# EAGLE board SteppyMk2 (EAGLE 9.2.2), part 1 of 2
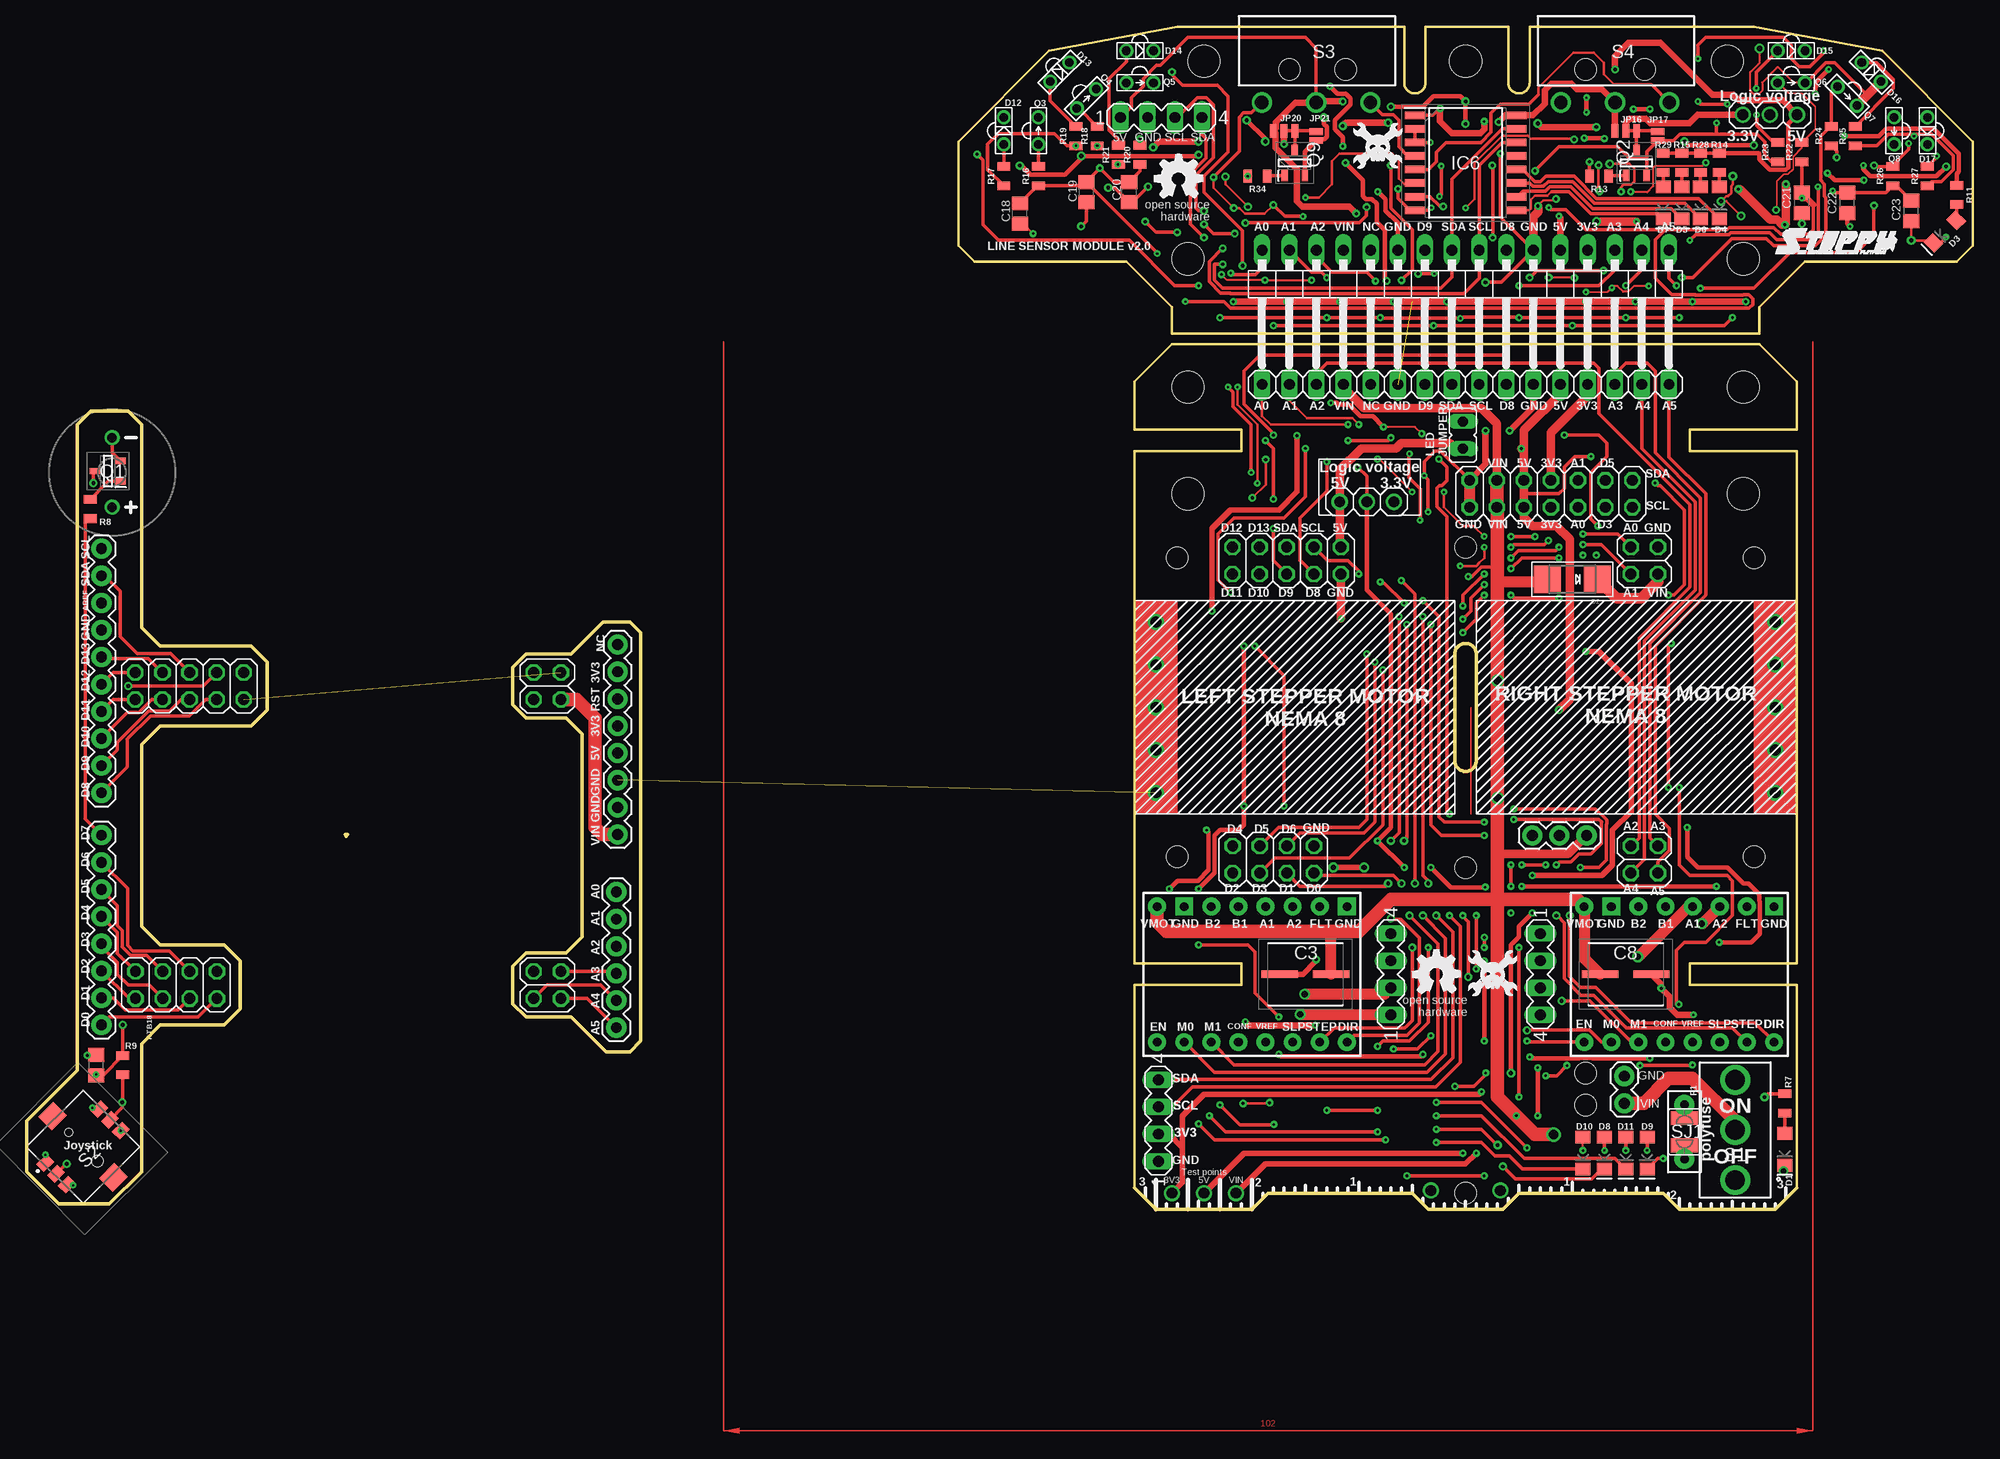
[diagram p3: board, top side]
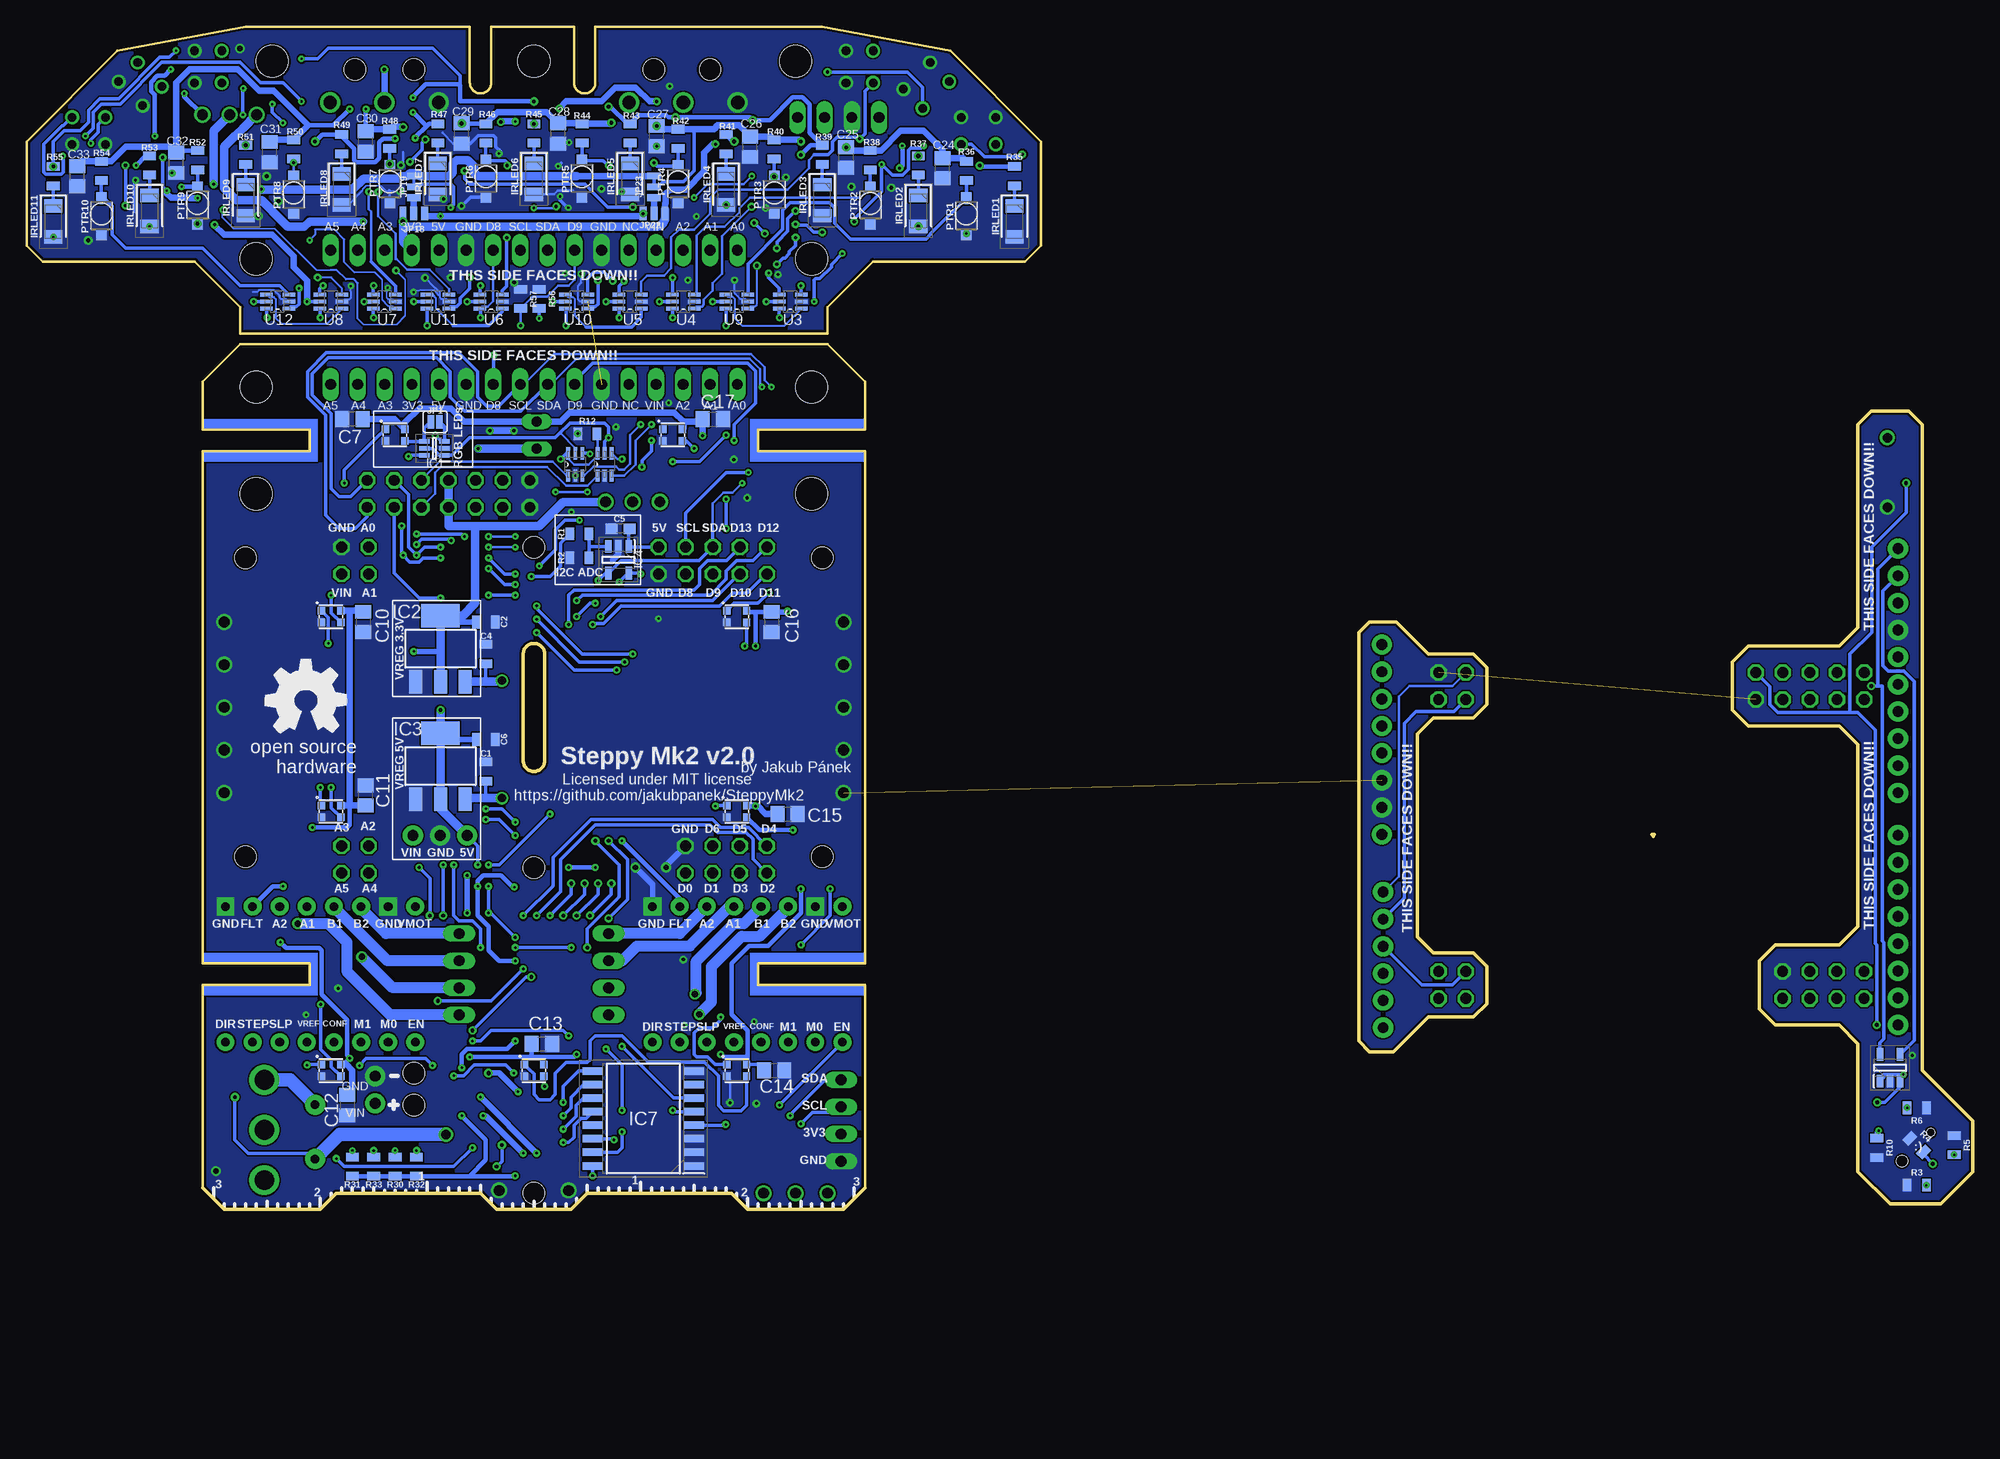
[diagram p4: board, bottom side, seen from below]

Size 182.25 x 110.75 mm. Coordinates in mm from the lower left corner, seen from the top.
Outline: 29.83,35.11 30.06,35.11
Outline: 29.93,35.09 29.93,34.91
Outline: 107.25,82 162.25,82 162.25,84.5 166.5,88.75 180.75,88.75 182.25,90.25 182.25,100 173.75,108.5 161.75,110.75 140.75,110.75 140.75,105.5 arc-90 139.75,104.5 arc-90 138.75,105.5 138.75,110.75 131,110.75 131,105.5 arc-90 130,104.5 arc-90 129,105.5 129,110.75 107.75,110.75 95.75,108.5 87.25,100 87.25,90.25 88.75,88.75 103,88.75 107.25,84.5 107.25,82
Outline: 7.75,0.5 3,0.5 0,3.5 0,8.25 4.75,13 4.75,73.5 6,74.75 9.5,74.75 10.75,73.5 10.75,54.5 12.5,52.75 21,52.75 22.5,51.25 22.5,46.75 21,45.25 12.5,45.25 10.75,43.5 10.75,26.5 12.5,24.75 18.5,24.75 20,23.25 20,18.75 18.5,17.25 12.5,17.25 10.75,15.5 10.75,3.5 7.75,0.5
Outline: 54.25,14.75 56.5,14.75 57.5,15.75 57.5,54 56.5,55 54,55 51,52 46.75,52 45.5,50.75 45.5,47.25 46.75,46 50.5,46 52,44.5 52,25.5 50.5,24 46.75,24 45.5,22.75 45.5,19.25 46.75,18 51,18 54.25,14.75
Outline: 105.75,0 114.75,0 116.25,1.5 129.75,1.5 131.25,0 138.25,0 139.75,1.5 153.25,1.5 154.75,0 163.75,0 165.75,2 165.75,21 155.75,21 155.75,23 165.75,23 165.75,71 155.75,71 155.75,73 165.75,73 165.75,77.5 162.25,81 107.25,81 103.75,77.5 103.75,73 113.75,73 113.75,71 103.75,71 103.75,23 113.75,23 113.75,21 103.75,21 103.75,2 105.75,0
Outline: 133.75,42 133.75,52 arc-90 134.75,53 arc-90 135.75,52 135.75,42 arc-90 134.75,41 arc-90 133.75,42
Copper layers (1*16): Top 0.035mm / dielectric 1.5mm / Bottom 0.035mm
Design rules "default *": minimum track width 6mil, minimum drill 0.2mm, track to track 6mil, track to pad 6mil, pad to pad 6mil, via to via 6mil, smd to smd 6mil, copper to edge 0.2mm, drill to drill 6mil, minimum pad ring 10mil, minimum via ring 8mil, stop-mask expansion 4mil, vias tented up to drill 0mil, thermal gap 10mil
Holes 2 mm at 134.75,32 134.75,62 146,106.75 151.5,106.75 118.25,106.75 123.5,106.75 134.75,1.5 146,12.75 146,9.75 107.75,33 107.75,61 161.75,33 161.75,61
Holes 3 mm at 160.75,77 108.75,77 108.75,89 160.75,89 110.25,107.5 159.25,107.5 108.75,67 160.75,67 134.75,107.5

## Footprints (pad centres in the part's own frame; a part is rotated, then mirrored left to right if it is on the bottom)
0805 = smd 0.8 x 1.2: 1 -0.9,0; 2 0.9,0
CAPM7058X610N = smd 3.4 x 0.7: 1 -2.4,0; 2 2.4,0
0603 = smd 1.1 x 1: 1 -0.85,0; 2 0.85,0
C0805 = smd 1.3 x 1.5: 1 -0.95,0; 2 0.95,0
LED-1206 = smd 1.2 x 1.4: A -1.5,0; C 1.5,0
SMADIODE = smd 2.54 x 2.54: A 2.349,0; C -2.349,0
LTE-302 = drill 0.8: A 1.27,0; C -1.27,0
POLOLU-DRV8825 = drill 0.8 pad 1.676: A1 6.35,-1.27; A2 6.35,-3.81; B1 6.35,1.27; B2 6.35,3.81; CONFIG -6.35,1.27; DIR -6.35,-8.89; EN -6.35,8.89; FLT 6.35,-6.35; M0 -6.35,6.35; M1 -6.35,3.81; SLP -6.35,-3.81; STEP -6.35,-6.35; VMOT 6.35,8.89; VREF -6.35,-1.27 | drill 0.8 pad 1.676 square: GND0 6.35,6.35; GND1 6.35,-8.89
PTH = drill 0.8 pad 1.88: P$1 -2.54,0; P$2 2.54,0
SOT65P210X110-6N = smd 1 x 0.45: 1 -0.95,0.65; 2 -0.95,0; 3 -0.95,-0.65; 4 0.95,-0.65; 5 0.95,0; 6 0.95,0.65
SOT223 = smd 1.219 x 2.235: 1 -2.311,-3.099; 2 0,-3.099; 3 2.311,-3.099 | smd 3.6 x 2.2: TAB 0,3.099
SOT95P280X145-5N = smd 1.2 x 0.6: 1 -1.25,0.95; 2 -1.25,0; 3 -1.25,-0.95; 4 1.25,-0.95; 5 1.25,0.95
SOIC127P1032X265-16N = smd 1.95 x 0.7: 1 -4.725,4.445; 2 -4.725,3.175; 3 -4.725,1.905; 4 -4.725,0.635; 5 -4.725,-0.635; 6 -4.725,-1.905; 7 -4.725,-3.175; 8 -4.725,-4.445; 9 4.725,-4.445; 10 4.725,-3.175; 11 4.725,-1.905; 12 4.725,-0.635; 13 4.725,0.635; 14 4.725,1.905; 15 4.725,3.175; 16 4.725,4.445
LEDC3215X130N = smd 1.25 x 1.7: 1 -1.45,0; 2 1.45,0
1X02 = drill 1.016 pad 1.88: 1 0,0; 2 2.54,0
1X08 = drill 1.016 pad 1.88: 1 0,0; 2 2.54,0; 3 5.08,0; 4 7.62,0; 5 10.16,0; 6 12.7,0; 7 15.24,0; 8 17.78,0
1X06 = drill 1.016 pad 1.88: 1 0,0; 2 2.54,0; 3 5.08,0; 4 7.62,0; 5 10.16,0; 6 12.7,0
1X10 = drill 1.016 pad 1.88: 1 0,0; 2 2.54,0; 3 5.08,0; 4 7.62,0; 5 10.16,0; 6 12.7,0; 7 15.24,0; 8 17.78,0; 9 20.32,0; 10 22.86,0
1X03 = drill 1.016 pad 1.88: 1 0,0; 2 2.54,0; 3 5.08,0
SMT-JUMPER_2_NC_PASTE_SILK = smd 0.635 x 1.27: 1 -0.406,0; 2 0.406,0
JP1 = drill 0.914 long: 1 0,-1.27; 2 0,1.27
2X02 = drill 1.016 octagon: 1 -1.27,-1.27; 2 -1.27,1.27; 3 1.27,-1.27; 4 1.27,1.27
2X07 = drill 1.016 octagon: 1 -7.62,-1.27; 2 -7.62,1.27; 3 -5.08,-1.27; 4 -5.08,1.27; 5 -2.54,-1.27; 6 -2.54,1.27; 7 0,-1.27; 8 0,1.27; 9 2.54,-1.27; 10 2.54,1.27; 11 5.08,-1.27; 12 5.08,1.27; 13 7.62,-1.27; 14 7.62,1.27
2X05 = drill 1.016 octagon: 1 -5.08,-1.27; 2 -5.08,1.27; 3 -2.54,-1.27; 4 -2.54,1.27; 5 0,-1.27; 6 0,1.27; 7 2.54,-1.27; 8 2.54,1.27; 9 5.08,-1.27; 10 5.08,1.27
2X04 = drill 1.016 octagon: 1 -3.81,-1.27; 2 -3.81,1.27; 3 -1.27,-1.27; 4 -1.27,1.27; 5 1.27,-1.27; 6 1.27,1.27; 7 3.81,-1.27; 8 3.81,1.27
1X16/90 = drill 1.016 long: 1 -19.05,-3.81; 2 -16.51,-3.81; 3 -13.97,-3.81; 4 -11.43,-3.81; 5 -8.89,-3.81; 6 -6.35,-3.81; 7 -3.81,-3.81; 8 -1.27,-3.81; 9 1.27,-3.81; 10 3.81,-3.81; 11 6.35,-3.81; 12 8.89,-3.81; 13 11.43,-3.81; 14 13.97,-3.81; 15 16.51,-3.81; 16 19.05,-3.81
1X16 = drill 1.016 long: 1 -19.05,0; 2 -16.51,0; 3 -13.97,0; 4 -11.43,0; 5 -8.89,0; 6 -6.35,0; 7 -3.81,0; 8 -1.27,0; 9 1.27,0; 10 3.81,0; 11 6.35,0; 12 8.89,0; 13 11.43,0; 14 13.97,0; 15 16.51,0; 16 19.05,0
1X03' = drill 1.016: 1 -2.54,0; 2 0,0; 3 2.54,0
SMT-JUMPER_3_1-NC_TRACE_NO-SILK = smd 0.635 x 1.27: 1 -1.016,0; 2 0,0; 3 1.016,0
SMT-JUMPER_2_NO_NO-SILK = smd 0.635 x 1.27: 1 -0.406,0; 2 0.406,0
SMT-JUMPER_3_0-NO_TRACE_NO-SILK = smd 0.635 x 1.27: 1 -1.016,0; 2 0,0; 3 1.016,0
BUZZER-12MM-NS = drill 0.9: + 3.25,0; - -3.25,0
WS2812-2020 = smd 0.7 x 0.7: 1 0.915,-0.55; 2 0.915,0.55; 3 -0.915,0.55; 4 -0.915,-0.55
TEMT1020 = smd 1.1 x 1: 1 -1.7,0; 2 1.7,0
SOT96P237X111-3N = smd 1 x 0.6: 1 -1.2,0.955; 2 -1.2,-0.955; 3 1.2,0
LTR-301 = drill 0.8: C 1.27,0; E -1.27,0
5MS1S102AM2QES = drill 1.85 pad 2.8: 1 0,-4.7; 2 0,0; 3 0,4.7
SKRHABE010 = smd 1.35 x 1: 1 -3.575,1.425; 2 -3.575,0; 3 -3.575,-1.425; 4 3.575,1.425; 5 3.575,0; 6 3.575,-1.425 | smd 2 x 1.8: 7 0,4.05; 8 0,-4.05 | hole 0.75: 0,1.9 | hole 1.05: 0,-1.9
AH186061A = drill 1.25 pad 1.9: 1 -5.08,1.6; 2 0,1.6; 3 5.08,1.6
SJW = smd 1.27 x 2.54: 1 -1.27,0; 2 1.27,0
MA04-1 = drill 1.016 long: 1 -3.81,0; 2 -1.27,0; 3 1.27,0; 4 3.81,0
SOT65P210X110-6N' = smd 1.168 x 0.356: 1 -1.041,0.66; 2 -1.041,0; 3 -1.041,-0.66; 4 1.041,-0.66; 5 1.041,0; 6 1.041,0.66

## Placement (x,y rotation side)
C1  10uF  [0805]  139.25,41 90 bottom
C2  10uF  [0805]  139.25,55 0 bottom
C3  100UF  [CAPM7058X610N]  119.75,22 0 top
C4  10uF  [0805]  139.25,52 90 bottom
C5  0.1uF  [0603]  126.63,63.73 180 bottom
C6  10uF  [0805]  139.25,44 0 bottom
C7  0.1uF  [C0805]  151.75,74 180 bottom
C8  100UF  [CAPM7058X610N]  149.75,22 180 top
C9  0.1uF  [C0805]  6.5,13.5 90 top
C10  0.1uF  [C0805]  150.75,55 270 bottom
C11  0.1uF  [C0805]  150.5,38.75 90 bottom
C12  0.1uF  [C0805]  152.25,9.75 270 bottom
C13  0.1uF  [C0805]  134,15.5 0 bottom
C14  0.1uF  [C0805]  112.25,13 0 bottom
C15  0.1uF  [C0805]  111,37 0 bottom
C16  0.1uF  [C0805]  112.5,55 270 bottom
C17  0.1uF  [C0805]  118,74 0 bottom
C18  [C0805]  93,93.25 90 top
C19  [C0805]  99.25,95.25 90 top
C20  [C0805]  103.25,95.25 90 top
C21  [C0805]  166.25,94.25 90 top
C22  [C0805]  170.5,94.25 90 top
C23  [C0805]  176.5,93.5 90 top
C24  [C0805]  96.5,97.5 90 bottom
C25  [C0805]  105.5,98.5 90 bottom
C26  [C0805]  114.5,99.5 90 bottom
C27  [C0805]  123.25,100.5 90 bottom
C28  [C0805]  132.5,100.75 90 bottom
C29  [C0805]  141.5,100.75 90 bottom
C30  [C0805]  150.5,100 90 bottom
C31  [C0805]  159.5,99 90 bottom
C32  [C0805]  168.25,98 90 bottom
C33  [C0805]  177.5,96.75 90 bottom
D1  GREEN  [LED-1206]  164.65,5.6 270 top
D2  [SMADIODE]  144.75,59 180 top
D3  GREEN  [LED-1206]  179.64,91.55 225 top
D4  GREEN  [LED-1206]  158.5,94.25 270 top
D5  GREEN  [LED-1206]  155,94.25 270 top
D6  GREEN  [LED-1206]  156.75,94.25 270 top
D7  GREEN  [LED-1206]  153.25,94.25 270 top
D8  GREEN  [LED-1206]  147.75,5.25 270 top
D9  GREEN  [LED-1206]  151.75,5.25 270 top
D10  GREEN  [LED-1206]  145.75,5.25 270 top
D11  GREEN  [LED-1206]  149.75,5.25 270 top
D12  [LTE-302]  91.5,101 270 top
D13  [LTE-302]  96.75,106.5 225 top
D14  [LTE-302]  104.25,108.5 180 top
D15  [LTE-302]  165.25,108.5 180 top
D16  [LTE-302]  172.75,106.5 135 top
D17  [LTE-302]  178,101 90 top
DRV1  POLOLU-DRV8825  [POLOLU-DRV8825]  154.75,22 90 top
DRV2  POLOLU-DRV8825  [POLOLU-DRV8825]  114.75,22 90 top
F1  [PTH]  155.25,7.25 270 top
GOLD_ORB_SM1  OSHWLOGOLOGO8MM  [OSHW_8MM]  156.12,47.62 0 bottom
GOLD_ORB_SM2  OSHWLOGOLOGO5MM  [OSHW_5MM]  132,22 0 top
GOLD_ORB_SM3  OSHWLOGOLOGO5MM  [OSHW_5MM]  107.88,96.5 0 top
IC1  74LVC1T45GW,125  [SOT65P210X110-6N]  144.07,71.26 180 bottom
IC2  AP1117E33G-13  [SOT223]  143.5,52.5 0 bottom
IC3  TS1117BCW-5.0  [SOT223]  143.5,41.5 0 bottom
IC4  MCP3021A0T-E_OT  [SOT95P280X145-5N]  126.83,60.83 270 bottom
IC5  MCP3021A1T-E_OT  [SOT95P280X145-5N]  7.75,13.25 90 bottom
IC6  PCF8574T_3,518  [SOIC127P1032X265-16N]  134.75,98 0 top
IC7  PCF8574T_3,518  [SOIC127P1032X265-16N]  124.5,8.5 180 bottom
IRLED1  LL-S150IRC-2A  [LEDC3215X130N]  89.75,92.5 270 bottom
IRLED2  LL-S150IRC-2A  [LEDC3215X130N]  98.75,93.5 270 bottom
IRLED3  LL-S150IRC-2A  [LEDC3215X130N]  107.75,94.5 270 bottom
IRLED4  LL-S150IRC-2A  [LEDC3215X130N]  116.75,95.5 270 bottom
IRLED5  LL-S150IRC-2A  [LEDC3215X130N]  125.75,96.5 270 bottom
IRLED6  LL-S150IRC-2A  [LEDC3215X130N]  134.75,96.5 270 bottom
IRLED7  LL-S150IRC-2A  [LEDC3215X130N]  143.75,96.5 270 bottom
IRLED8  LL-S150IRC-2A  [LEDC3215X130N]  152.75,95.5 270 bottom
IRLED9  LL-S150IRC-2A  [LEDC3215X130N]  161.75,94.5 270 bottom
IRLED10  LL-S150IRC-2A  [LEDC3215X130N]  170.75,93.5 270 bottom
IRLED11  LL-S150IRC-2A  [LEDC3215X130N]  179.75,92.5 270 bottom
J1  [1X02]  149.62,12.46 270 top
J2  [1X08]  55.34,52.88 270 top
J3  [1X06]  55.22,29.71 270 top
J4  [1X10]  7,39 90 top
J5  [1X08]  7,17.25 90 top
J6  455-1750-1-ND  [1X03]  141,35 0 top
JP1  JUMPER-SMT_2_NC_PASTE_SILK  [SMT-JUMPER_2_NC_PASTE_SILK]  144,73.75 180 bottom
JP2  [JP1]  134.5,72.5 180 top
JP3  [2X02]  48.75,49 270 top
JP4  [2X02]  48.75,21 270 top
JP5  [2X07]  142.75,67 180 top
JP6  [2X05]  15.25,49 180 top
JP7  [2X04]  14,21 180 top
JP8  [2X02]  151.5,60.75 270 top
JP9  [2X02]  151.5,32.75 270 top
JP10  [2X05]  118,60.75 180 top
JP11  [2X04]  116.75,32.75 180 top
JP12  [1X16/90]  134.75,86 180 top
JP13  [1X16]  134.75,77.25 0 top
JP14  [1X03']  163.25,102.5 0 top
JP15  [1X03']  125.5,66.25 180 top
JP16  JUMPER-SMT_3_1-NC_TRACE_NO-SILK  [SMT-JUMPER_3_1-NC_TRACE_NO-SILK]  149.75,101 0 top
JP17  JUMPER-SMT_2_NO_NO-SILK  [SMT-JUMPER_2_NO_NO-SILK]  152.75,100.5 90 top
JP18  JUMPER-SMT_3_NO_NO_SILK  [SMT-JUMPER_3_0-NO_TRACE_NO-SILK]  146,93.25 180 bottom
JP19  JUMPER-SMT_3_1-NC_TRACE_NO-SILK  [SMT-JUMPER_3_1-NC_TRACE_NO-SILK]  146,95.75 90 bottom
JP20  JUMPER-SMT_3_1-NC_TRACE_NO-SILK  [SMT-JUMPER_3_1-NC_TRACE_NO-SILK]  117.75,101 0 top
JP21  JUMPER-SMT_2_NO_NO-SILK  [SMT-JUMPER_2_NO_NO-SILK]  120.75,100.5 90 top
JP22  JUMPER-SMT_3_NO_NO_SILK  [SMT-JUMPER_3_0-NO_TRACE_NO-SILK]  123.5,93.25 0 bottom
JP23  JUMPER-SMT_3_1-NC_TRACE_NO-SILK  [SMT-JUMPER_3_1-NC_TRACE_NO-SILK]  123.5,95.75 90 bottom
LS1  BUZZER-PTH_NO_SILK  [BUZZER-12MM-NS]  8,69 270 top
PLED1  WS2812-2020  [WS2812-2020]  147.75,72.5 180 bottom
PLED2  WS2812-2020  [WS2812-2020]  153.75,55.5 180 bottom
PLED3  WS2812-2020  [WS2812-2020]  153.75,37.25 180 bottom
PLED4  WS2812-2020  [WS2812-2020]  153.75,13 180 bottom
PLED5  WS2812-2020  [WS2812-2020]  134.75,13 180 bottom
PLED6  WS2812-2020  [WS2812-2020]  115.75,13 180 bottom
PLED7  WS2812-2020  [WS2812-2020]  115.75,37.25 180 bottom
PLED8  WS2812-2020  [WS2812-2020]  115.75,55.5 180 bottom
PLED9  WS2812-2020  [WS2812-2020]  121.75,72.5 180 bottom
PTR1  TEMT1020  [TEMT1020]  94.25,93 270 bottom
PTR2  TEMT1020  [TEMT1020]  103.25,94 270 bottom
PTR3  TEMT1020  [TEMT1020]  112.25,95 270 bottom
PTR4  TEMT1020  [TEMT1020]  121.25,96 270 bottom
PTR5  TEMT1020  [TEMT1020]  130.25,96.5 270 bottom
PTR6  TEMT1020  [TEMT1020]  139.25,96.5 270 bottom
PTR7  TEMT1020  [TEMT1020]  148.25,96 270 bottom
PTR8  TEMT1020  [TEMT1020]  157.25,95 270 bottom
PTR9  TEMT1020  [TEMT1020]  166.25,94 270 bottom
PTR10  TEMT1020  [TEMT1020]  175.25,93 270 bottom
Q1  SBC817-40LT1G  [SOT96P237X111-3N]  7.6,69.13 180 top
Q2  SBC817-40LT1G  [SOT96P237X111-3N]  150.75,98 90 top
Q3  [LTR-301]  94.75,101 270 top
Q4  [LTR-301]  99.25,104 225 top
Q5  [LTR-301]  104.25,105.5 180 top
Q6  [LTR-301]  165.25,105.5 180 top
Q7  [LTR-301]  170.5,104.25 135 top
Q8  [LTR-301]  174.88,101 90 top
Q9  SBC817-40LT1G  [SOT96P237X111-3N]  118.75,98 90 top
R1  10K  [0805]  130.5,63.25 0 bottom
R2  10K  [0805]  130.5,61 180 bottom
R3  8k2  [0805]  5.25,2.25 0 bottom
R4  4k7  [0805]  5.25,6 315 bottom
R5  2k  [0805]  1.75,6 270 bottom
R6  16k  [0805]  5.25,9.5 180 bottom
R7  4K7  [0805]  164.64,9.91 270 top
R8  4.7K  [0805]  5.94,65.58 270 top
R9  1M  [0805]  9,13.5 90 top
R10  33k  [0805]  9,5.75 270 bottom
R11  330  [0805]  180.75,95 270 top
R12  330K  [0805]  129.75,72.62 0 bottom
R13  4.7K  [0805]  147.25,96.75 180 top
R14  4k7  [0805]  158.5,98 270 top
R15  4k7  [0805]  155,98 270 top
R16  10K  [0805]  94.75,96.75 90 top
R17  330  [0805]  91.5,96.75 90 top
R18  10K  [0805]  100.25,100.5 90 top
R19  330  [0805]  98.25,100.5 90 top
R20  10K  [0805]  104.25,98.75 90 top
R21  330  [0805]  102.25,98.75 90 top
R22  10K  [0805]  166.25,99 90 top
R23  330  [0805]  164,99 90 top
R24  10K  [0805]  169,100.5 90 top
R25  330  [0805]  171.25,100.5 90 top
R26  10K  [0805]  174.75,96.75 90 top
R27  330  [0805]  178,96.75 90 top
R28  4k7  [0805]  156.75,98 270 top
R29  4k7  [0805]  153.25,98 270 top
R30  4k7  [0805]  147.75,4 90 bottom
R31  4k7  [0805]  151.75,4 90 bottom
R32  4k7  [0805]  145.75,4 90 bottom
R33  4k7  [0805]  149.75,4 90 bottom
R34  4.7K  [0805]  115.25,96.75 180 top
R35  330  [0805]  89.75,96.75 270 bottom
R36  10K  [0805]  94.25,97.25 270 bottom
R37  330  [0805]  98.75,97.75 270 bottom
R38  10K  [0805]  103.25,98.25 270 bottom
R39  330  [0805]  107.75,98.75 270 bottom
R40  10K  [0805]  112.25,99.25 270 bottom
R41  330  [0805]  116.75,99.75 270 bottom
R42  10K  [0805]  121.25,100.25 270 bottom
R43  330  [0805]  125.75,100.75 270 bottom
R44  10K  [0805]  130.25,100.75 270 bottom
R45  330  [0805]  134.75,100.75 270 bottom
R46  10K  [0805]  139.25,100.75 270 bottom
R47  330  [0805]  143.75,100.75 270 bottom
R48  10K  [0805]  148.25,100.25 270 bottom
R49  330  [0805]  152.75,99.75 270 bottom
R50  10K  [0805]  157.25,99.25 270 bottom
R51  330  [0805]  161.75,98.75 270 bottom
R52  10K  [0805]  166.25,98.25 270 bottom
R53  330  [0805]  170.75,97.75 270 bottom
R54  10K  [0805]  175.25,97.25 270 bottom
R55  330  [0805]  179.75,96.75 270 bottom
R56  330K  [0805]  134.25,85.25 270 bottom
R57  330K  [0805]  136,85.25 270 bottom
S1  5MS1S102AM2QES  [5MS1S102AM2QES]  159.99,7.42 0 top
S2  SKRHABE010  [SKRHABE010]  5.28,5.84 45 top
S3  AH186061A  [AH186061A]  120.75,105.25 180 top
S4  AH186061A  [AH186061A]  148.75,105.25 180 top
SJ1  [SJW]  155.25,7.25 270 top
SV1  [MA04-1]  141.75,22 270 top
SV2  [MA04-1]  127.75,22 90 top
SV3  [MA04-1]  105.98,8.31 90 top
SV4  [MA04-1]  106.25,102.25 0 top
U1  NC7SB3157P6X  [SOT65P210X110-6N']  128.12,69.75 90 bottom
U2  NC7SB3157P6X  [SOT65P210X110-6N']  130.88,69.75 90 bottom
U3  NC7SB3157P6X  [SOT65P210X110-6N']  110.75,85 180 bottom
U4  NC7SB3157P6X  [SOT65P210X110-6N']  120.75,85 180 bottom
U5  NC7SB3157P6X  [SOT65P210X110-6N']  125.75,85 180 bottom
U6  NC7SB3157P6X  [SOT65P210X110-6N']  138.75,85 180 bottom
U7  NC7SB3157P6X  [SOT65P210X110-6N']  148.75,85 180 bottom
U8  NC7SB3157P6X  [SOT65P210X110-6N']  153.75,85 180 bottom
U9  NC7SB3157P6X  [SOT65P210X110-6N']  115.75,85 180 bottom
U10  NC7SB3157P6X  [SOT65P210X110-6N']  130.75,85 180 bottom
U11  NC7SB3157P6X  [SOT65P210X110-6N']  143.75,85 180 bottom
U12  NC7SB3157P6X  [SOT65P210X110-6N']  158.75,85 180 bottom